# Altium project TrackCommenderCar_v1.1_041225.PrjPcb
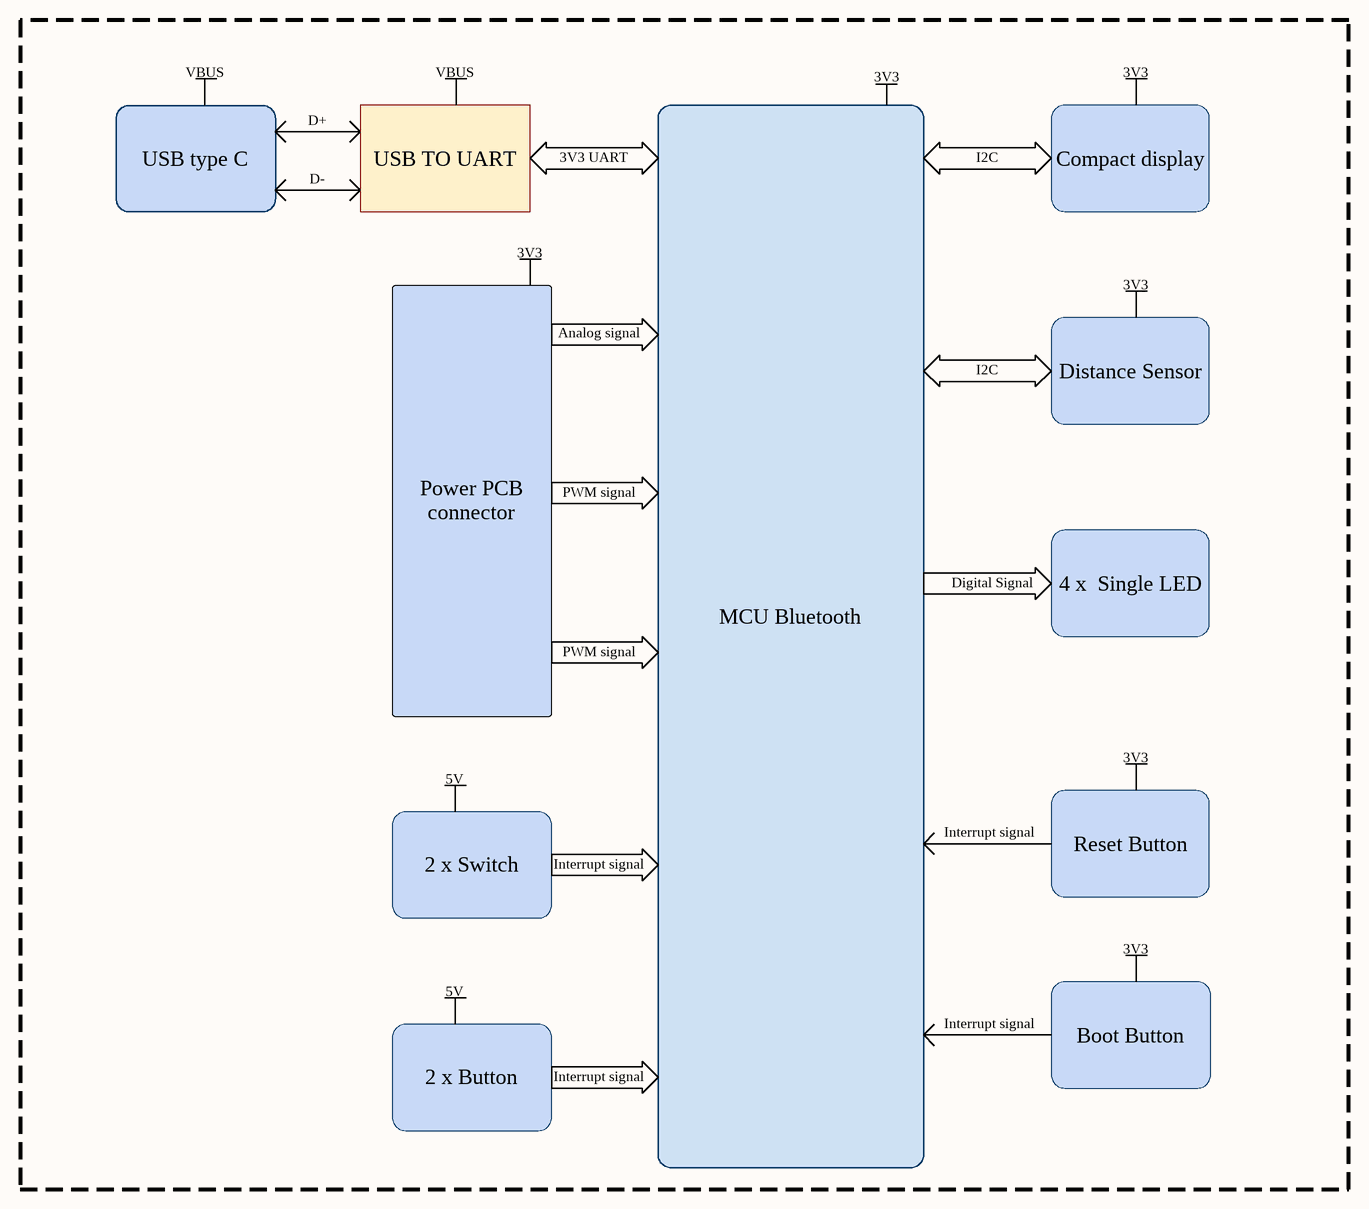
[diagram p0: OverView_TrackCommenderCar_FunctionPart.SchDoc]
2 sheets, 31 parts. Net scope: flat (ports and power ports of the same name join across sheets).
Board file: TrackCommanderCar.PcbDoc
Sheets:
  OverView_TrackCommenderCar_FunctionPart.SchDoc
  Sch_TrackCommenderCar_FunctionPart.SchDoc

## Sheet OverView_TrackCommenderCar_FunctionPart.SchDoc
size 420 x 297 mm; SheetNumber: 1; SheetTotal: 2

### Notes on the sheet
- VBUS
- 3V3
- D+
- USB type C
- D-
- USB TO UART
- 3V3 UART
- I2C
- Compact display
- Analog signal
- Distance Sensor
- Power PCB connector
- PWM signal
- Digital Signal
- 4 x  Single LED
- MCU Bluetooth
- 5V
- 2 x Switch
- Interrupt signal
- Reset Button
- 2 x Button
- Boot Button

## Sheet Sch_TrackCommenderCar_FunctionPart.SchDoc
size 381 x 241 mm; SheetNumber: 3; SheetTotal: 3
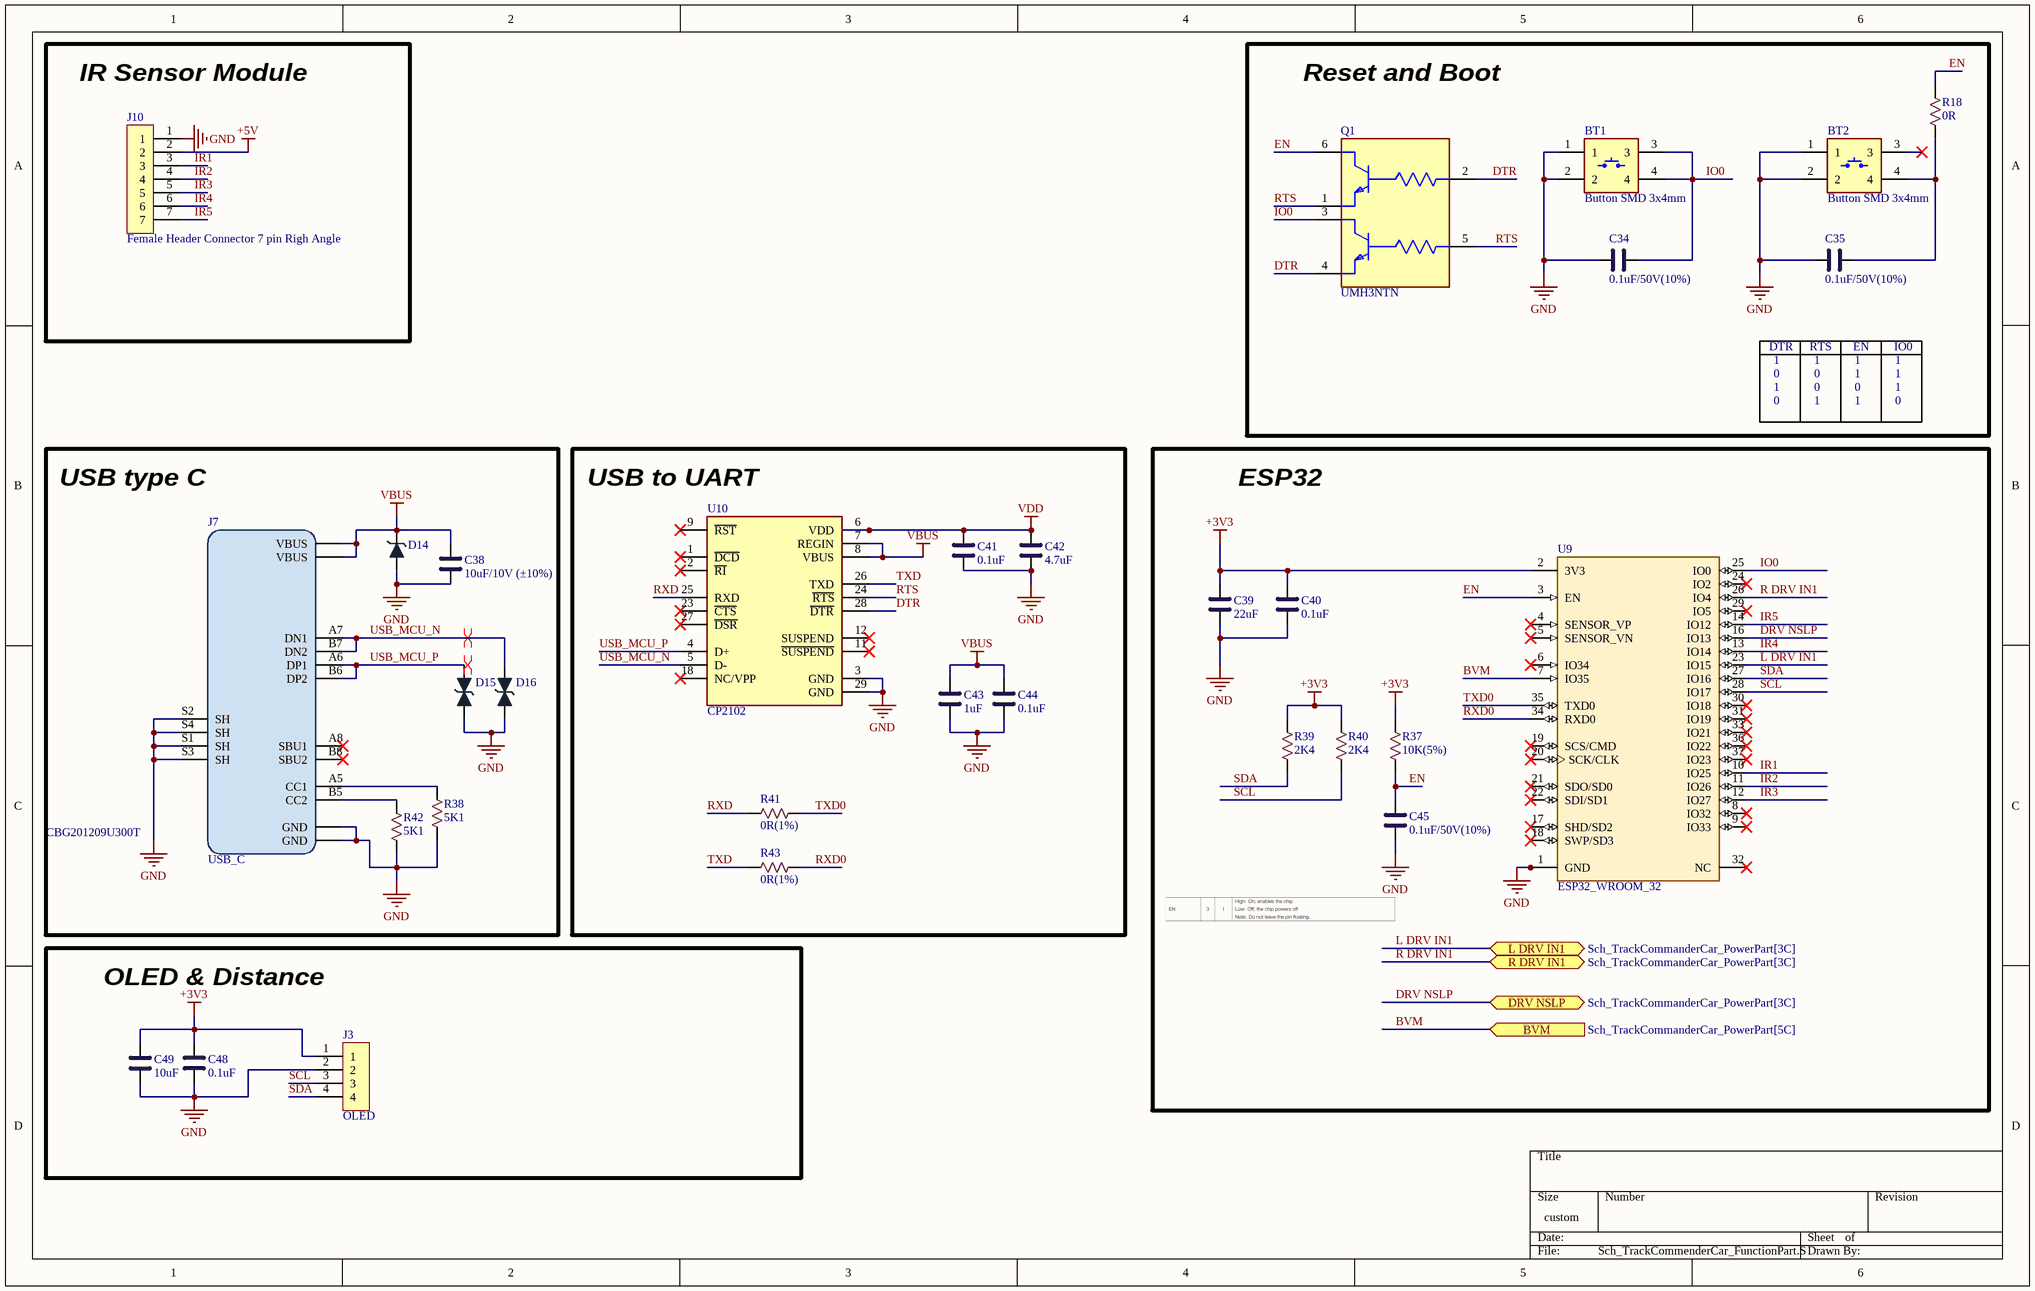
[diagram p1: Sch_TrackCommenderCar_FunctionPart.SchDoc]

### Parts
BT1  Button SMD 3x4mm  [Button SMD 3x4mm]
BT2  Button SMD 3x4mm  [Button SMD 3x4mm]
C34  0.1uF/50V(10%)  [C_0402]
C35  0.1uF/50V(10%)  [C_0402]
C38  10uF/10V (±10%)  [C_0603]
C39  22uF  [C_0603]
C40  0.1uF  [C_0402]
C41  0.1uF  [C_0402]
C42  4.7uF  [C_0603]
C43  1uF  [C_0603]
C44  0.1uF  [C_0402]
C45  0.1uF/50V(10%)  [C_0402]
C48  0.1uF  [C_0402]
C49  10uF  [C_0603]
D14  TVS_SMAJ_XA  [TVS_SMAJ_XA]  (value not drawn)
D15  TVS_RCLAMP0521P  [TVS_RCLAMP0521P]  (value not drawn)
D16  TVS_RCLAMP0521P  [TVS_RCLAMP0521P]  (value not drawn)
J3  OLED  [Header Female 1x4 2.54mm]
J7  USB_C  [USB_C_16Pin]
J10  Female Header Connector 7 pin Righ Angle  [7 Position Receptacle Connector 0.100" (2.54mm) Through Hole, Right Angle]
Q1  UMH3NTN  [UMH3N SOT363]
R18  0R  [R_0402]
R37  10K(5%)  [R_0402]
R38  5K1  [R_0402]
R39  2K4  [R_0402]
R40  2K4  [R_0402]
R41  0R(1%)  [R_0402]
R42  5K1  [R_0402]
R43  0R(1%)  [R_0402]
U9  ESP32_WROOM_32  [ESP32_Wroom_32]
U10  CP2102  [CP2102]

### Blocks framed on the sheet
CBG201209U300T: C38 D14-D16 J7 R38 R42

### Ports
BVM (in, see Sch_TrackCommanderCar_PowerPart[5C]), DRV NSLP (bidir, see Sch_TrackCommanderCar_PowerPart[3C]), L DRV IN1 (bidir, see Sch_TrackCommanderCar_PowerPart[3C]), R DRV IN1 (bidir, see Sch_TrackCommanderCar_PowerPart[3C])

### Nets
+3V3: C39.2 C40.2 C48.2 C49.2 J3.1 R37.2 R39.2 R40.2 U9.2(3V3)
+5V: J10.2
GND: BT1.1 BT1.2 BT2.1 BT2.2 C34.1 C35.1 C38.1 C39.1 C40.1 C41.1 C42.1 C43.1 C44.1 C45.1 C48.1 C49.1 D14.2(A) D15.1 D16.1 J3.2 J7.A1_B12(GND) J7.B1_A12(GND) J7.S1(SH) J7.S2(SH) J7.S3(SH) J7.S4(SH) J10.1 R38.1 R42.1 U9.1(GND) U9.15(GND) U9.38(GND) U9.GND U10.3(GND) U10.29(GND)
VBUS: C38.2 C43.2 C44.2 D14.1(C) J7.A4_B9(VBUS) J7.B4_A9(VBUS) U10.7(REGIN) U10.8(VBUS)
VDD: C41.2 C42.2 U10.6(VDD)
BVM: U9.7(IO35) ; port BVM
DRV NSLP: U9.16(IO13) ; port DRV NSLP
DTR: Q1.2(B) Q1.4(E) U10.28(~{DTR})
EN: C45.2 Q1.6(C) R18.2 R37.1 U9.3(EN)
IO0: BT1.3 BT1.4 C34.2 Q1.3(C) U9.25(IO0)
IR1: J10.3 U9.10(IO25)
IR2: J10.4 U9.11(IO26)
IR3: J10.5 U9.12(IO27)
IR4: J10.6 U9.13(IO14)
IR5: J10.7 U9.14(IO12)
L DRV IN1: U9.23(IO15) ; port L DRV IN1
R DRV IN1: U9.26(IO4) ; port R DRV IN1
RTS: Q1.1(E) Q1.5(B) U10.24(~{RTS})
RXD: R41.1 U10.25(RXD)
RXD0: R43.2 U9.34(RXD0)
SCL: J3.3 R40.1 U9.28(IO17)
SDA: J3.4 R39.1 U9.27(IO16)
TXD: R43.1 U10.26(TXD)
TXD0: R41.2 U9.35(TXD0)
USB_MCU_N: D16.2 J7.A7(DN1) J7.B7(DN2) U10.5(D-)
USB_MCU_P: D15.2 J7.A6(DP1) J7.B6(DP2) U10.4(D+)
NetBT2_4: BT2.4 C35.2 R18.1
NetJ7_A5: J7.A5(CC1) R38.2
NetJ7_B5: J7.B5(CC2) R42.2

Not connected (* = marked no-connect by the designer): BT2 3*; J7 A8(SBU1)* B8(SBU2)*; U9 4(SENSOR_VP)* 5(SENSOR_VN)* 6(IO34)* 8(IO32)* 9(IO33)* 17(SHD/SD2)* 18(SWP/SD3)* 19(SCS/CMD)* 20(SCK/CLK)* 21(SDO/SD0)* 22(SDI/SD1)* 24(IO2)* 29(IO5)* 30(IO18)* 31(IO19)* 32(NC)* 33(IO21)* 36(IO22)* 37(IO23)*; U10 1(~{DCD})* 2(~{RI})* 9(~{RST})* 11(~{SUSPEND})* 12(SUSPEND)* 18(NC/VPP)* 23(~{CTS})* 27(~{DSR})*

### Layout directives
differential pair: USB_MCU_N, USB_MCU_P

### Notes on the sheet
- IR Sensor Module
- Reset and Boot button
- DTR
- 1
- RTS
- EN
- IO0
- 0
- USB type C
- (near U10) USB to UART
- ESP32 WROOM32
- OLED & Distance Sensor

### Library data of the parts
C34 C35 C40 C41 C44 C45 C48 = C0402
C38 C39 C42 C43 C49 = C0603
J3 = Header Female 1x4 2.54mm
J7 = USB_C: 16_PIN
Q1 = UMH3NTN: Small Signal Bipolar Transistor, 0.1A I(C), 50V V(BR)CEO, 2-Element, NPN, Silicon; Manufacturer: ROHM; Collector Emitter Saturation Voltage: 300mV; Continuous Collector Current: 100mA; Element Configuration: Dual; Emitter Base Voltage (VEBO): 5V; hFE Min: 100; Max Junction Temperature (Tj): 150°C; Max Power Dissipation: 150mW; Number of Elements: 2; Transition Frequency: 250MHz; Supplier 1: DigiKey; Manufacturer Part Number: UMH3NTN; RoHS: Compliant; Category: BJTs; Stock 1: 7536; Pricing 1: 1=0.47, 10=0.29, 100=0.1836, 500=0.1375, 1000=0.12259 (USD); Case/Package: SOT-363; Collector Base Voltage (VCBO): 50V; Collector Emitter Breakdown Voltage: 50V; Collector Emitter Voltage (VCEO): 50V; Current Rating: 100mA; Height: 1mm; Lead Free: Lead Free; Lifecycle Status: Production; Max Breakdown Voltage: 50V; Max Collector Current: 100mA; Max Operating Temperature: 150°C; Max Output Current: 100mA; Min Operating Temperature: -55°C; Mount: Surface Mount; Number of Pins: 6; Number of Terminals: 6; Operating Supply Voltage: 50V; Polarity: NPN; Power Dissipation: 150mW; Radiation Hardening: No; REACH SVHC: Yes; Schedule B: 8541210080|8541210080|8541210080|8541210080|8541210080; Voltage Rating (DC): 50V; ComponentLink1URL: https://datasheet.octopart.com:443/UMH3NTN-ROHM-datasheet-181221233.pdf?src-supplier=Farnell; ComponentLink1Description: https://datasheet.octopart.com:443/UMH3NTN-ROHM-datasheet-181221233.pdf?src-supplier=Farnell; ComponentLink2URL: https://datasheet.octopart.com:443/UMH3NTN-Rohm-datasheet-82997545.pdf?src-supplier=Farnell; ComponentLink2Description: https://datasheet.octopart.com:443/UMH3NTN-Rohm-datasheet-82997545.pdf?src-supplier=Farnell; ComponentLink3URL: https://sigma.octopart.com:443/154577397/technical_drawing/ROHM-UMH3NTN.pdf?src-supplier=Upverter; ComponentLink3Description: https://sigma.octopart.com:443/154577397/technical_drawing/ROHM-UMH3NTN.pdf?src-supplier=Upverter; ComponentLink4URL: https://datasheet.octopart.com:443/UMH3NTN-Rohm-datasheet-548145.pdf?src-supplier=Newark; ComponentLink4Description: https://datasheet.octopart.com:443/UMH3NTN-Rohm-datasheet-548145.pdf?src-supplier=Newark; ComponentLink5URL: https://datasheet.octopart.com:443/UMH3NTN-Rohm-datasheet-41569966.pdf?src-supplier=Newark; ComponentLink5Description: https://datasheet.octopart.com:443/UMH3NTN-Rohm-datasheet-41569966.pdf?src-supplier=Newark; ComponentLink6URL: https://datasheet.octopart.com:443/UMH3NTN-Rohm-datasheet-142144791.pdf?src-supplier=Rohm+SCT; ComponentLink6Description: https://datasheet.octopart.com:443/UMH3NTN-Rohm-datasheet-142144791.pdf?src-supplier=Rohm+SCT; ComponentLink7URL: https://datasheet.octopart.com:443/UMH3NTN-Rohm-datasheet-61695679.pdf?src-supplier=Future+Electronics; ComponentLink7Description: https://datasheet.octopart.com:443/UMH3NTN-Rohm-datasheet-61695679.pdf?src-supplier=Future+Electronics; ComponentLink8URL: https://datasheet.octopart.com:443/UMH3NTN-Rohm-datasheet-21405252.pdf?src-supplier=element14+APAC; ComponentLink8Description: https://datasheet.octopart.com:443/UMH3NTN-Rohm-datasheet-21405252.pdf?src-supplier=element14+APAC; ComponentLink9URL: https://datasheet.octopart.com:443/UMH3NTN-Rohm-datasheet-31182.pdf?src-supplier=DigiKey; ComponentLink9Description: https://datasheet.octopart.com:443/UMH3NTN-Rohm-datasheet-31182.pdf?src-supplier=DigiKey; ComponentLink10URL: https://datasheet.octopart.com:443/UMH3NTN-Rohm-datasheet-14064263.pdf?src-supplier=iiiC; ComponentLink10Description: https://datasheet.octopart.com:443/UMH3NTN-Rohm-datasheet-14064263.pdf?src-supplier=iiiC; Supplier Part Number 1: UMH3NTNCT-ND
R18 R37-R43 = R0402